# EasyEDA Pro project ProProject_keyboard_Tassel43_2024-03-30.epro, board Tassel43_Without_RGB_Right
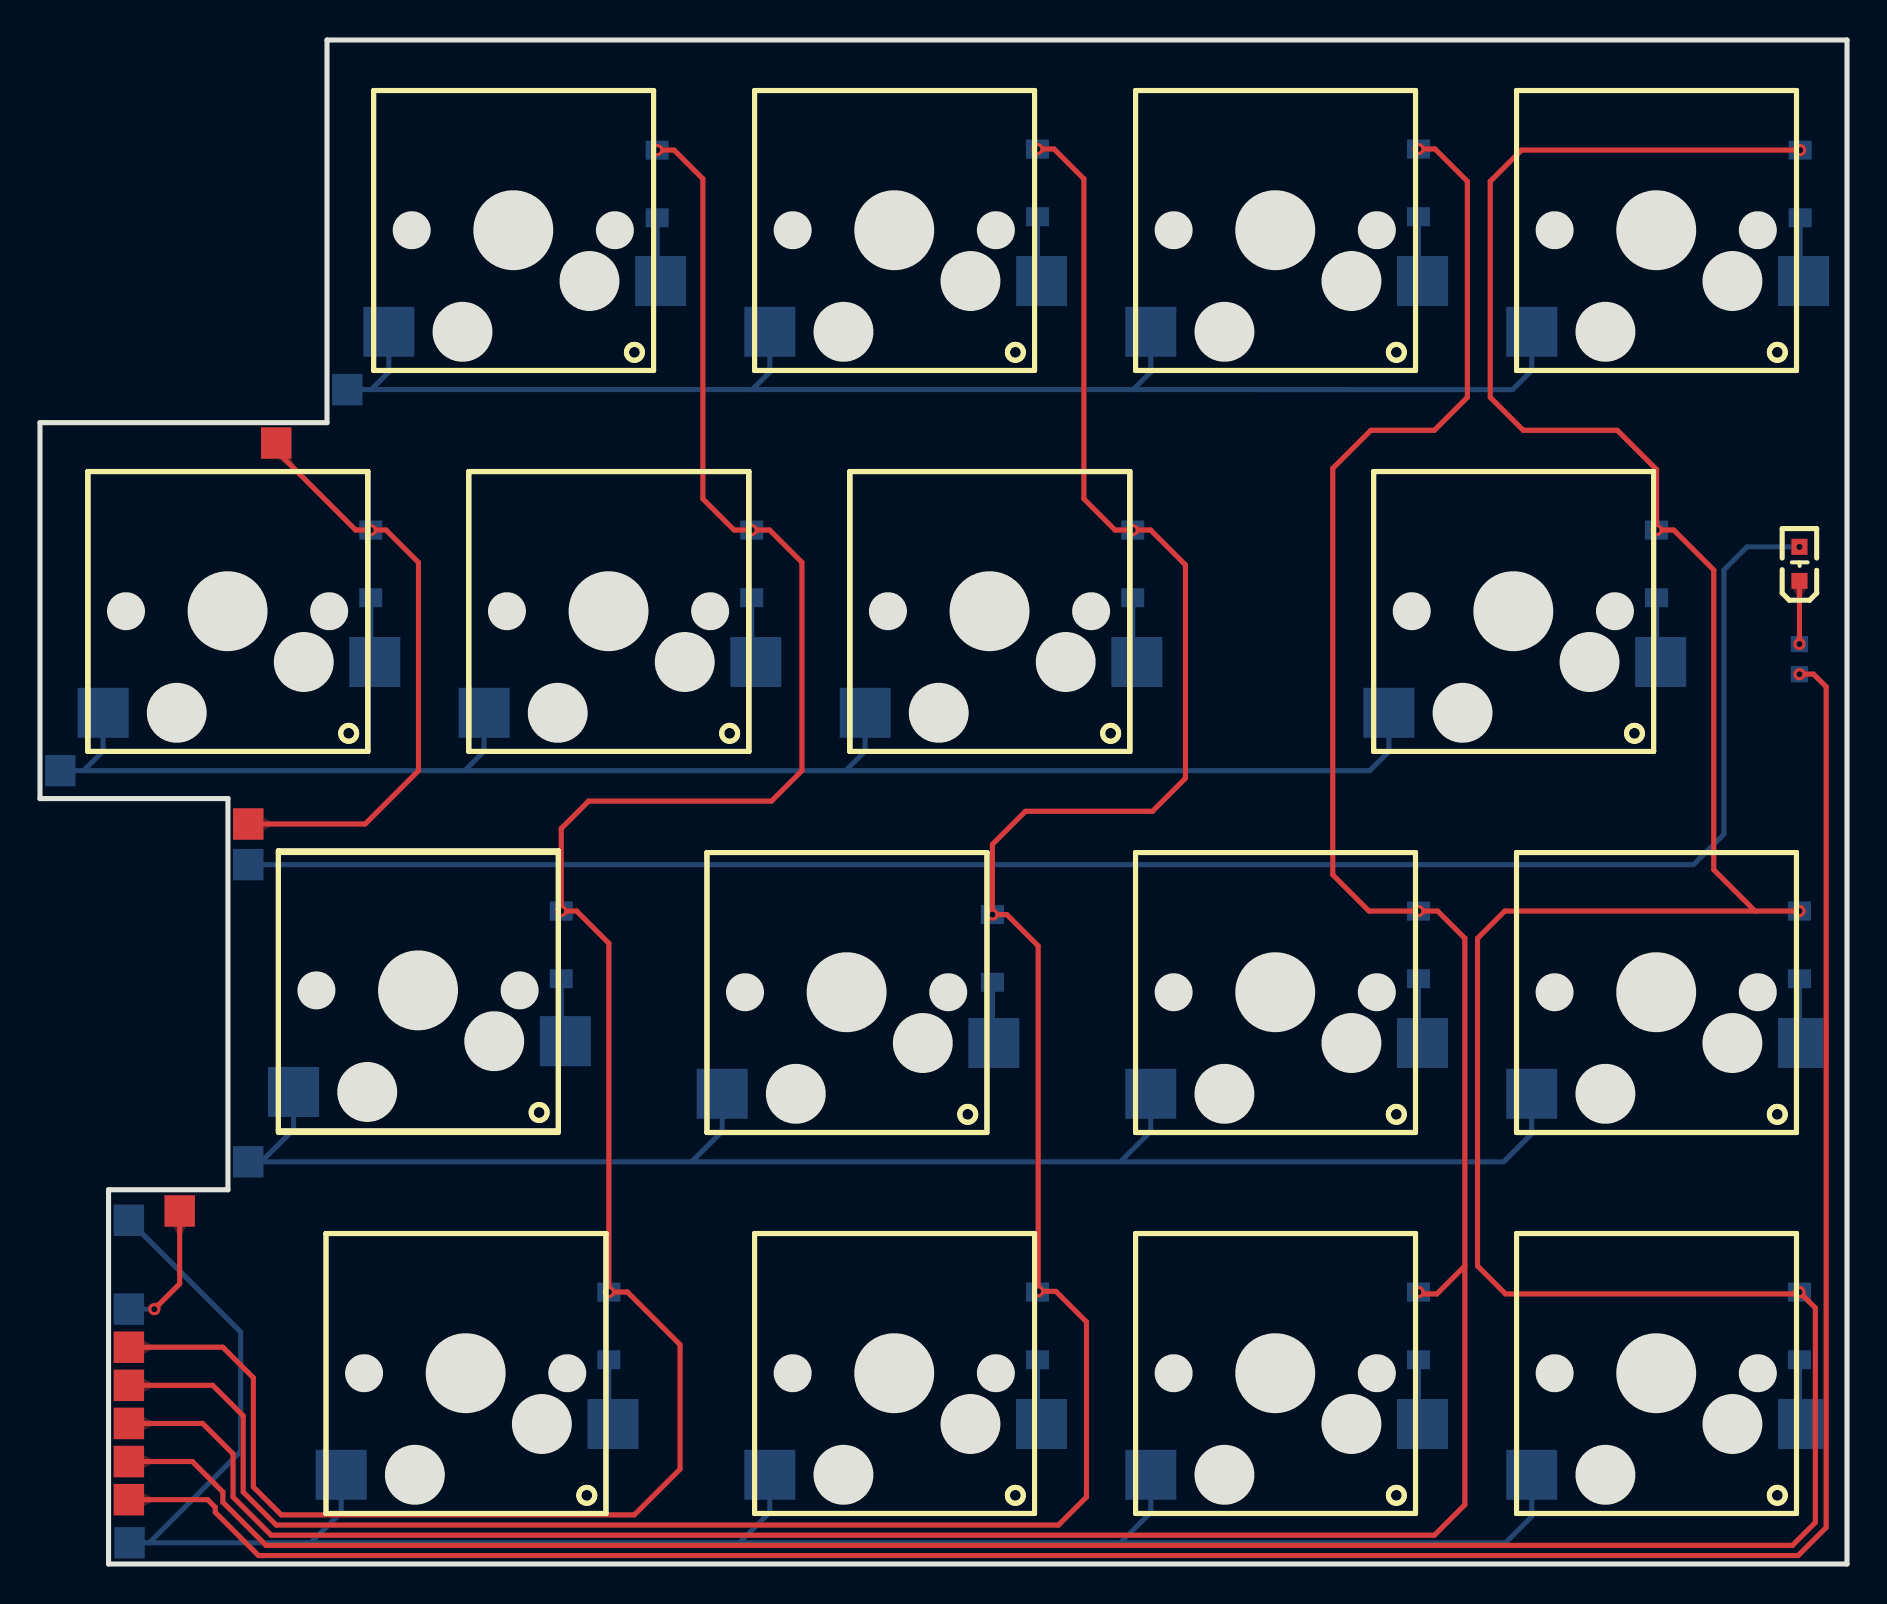
[diagram p7: board, top side]
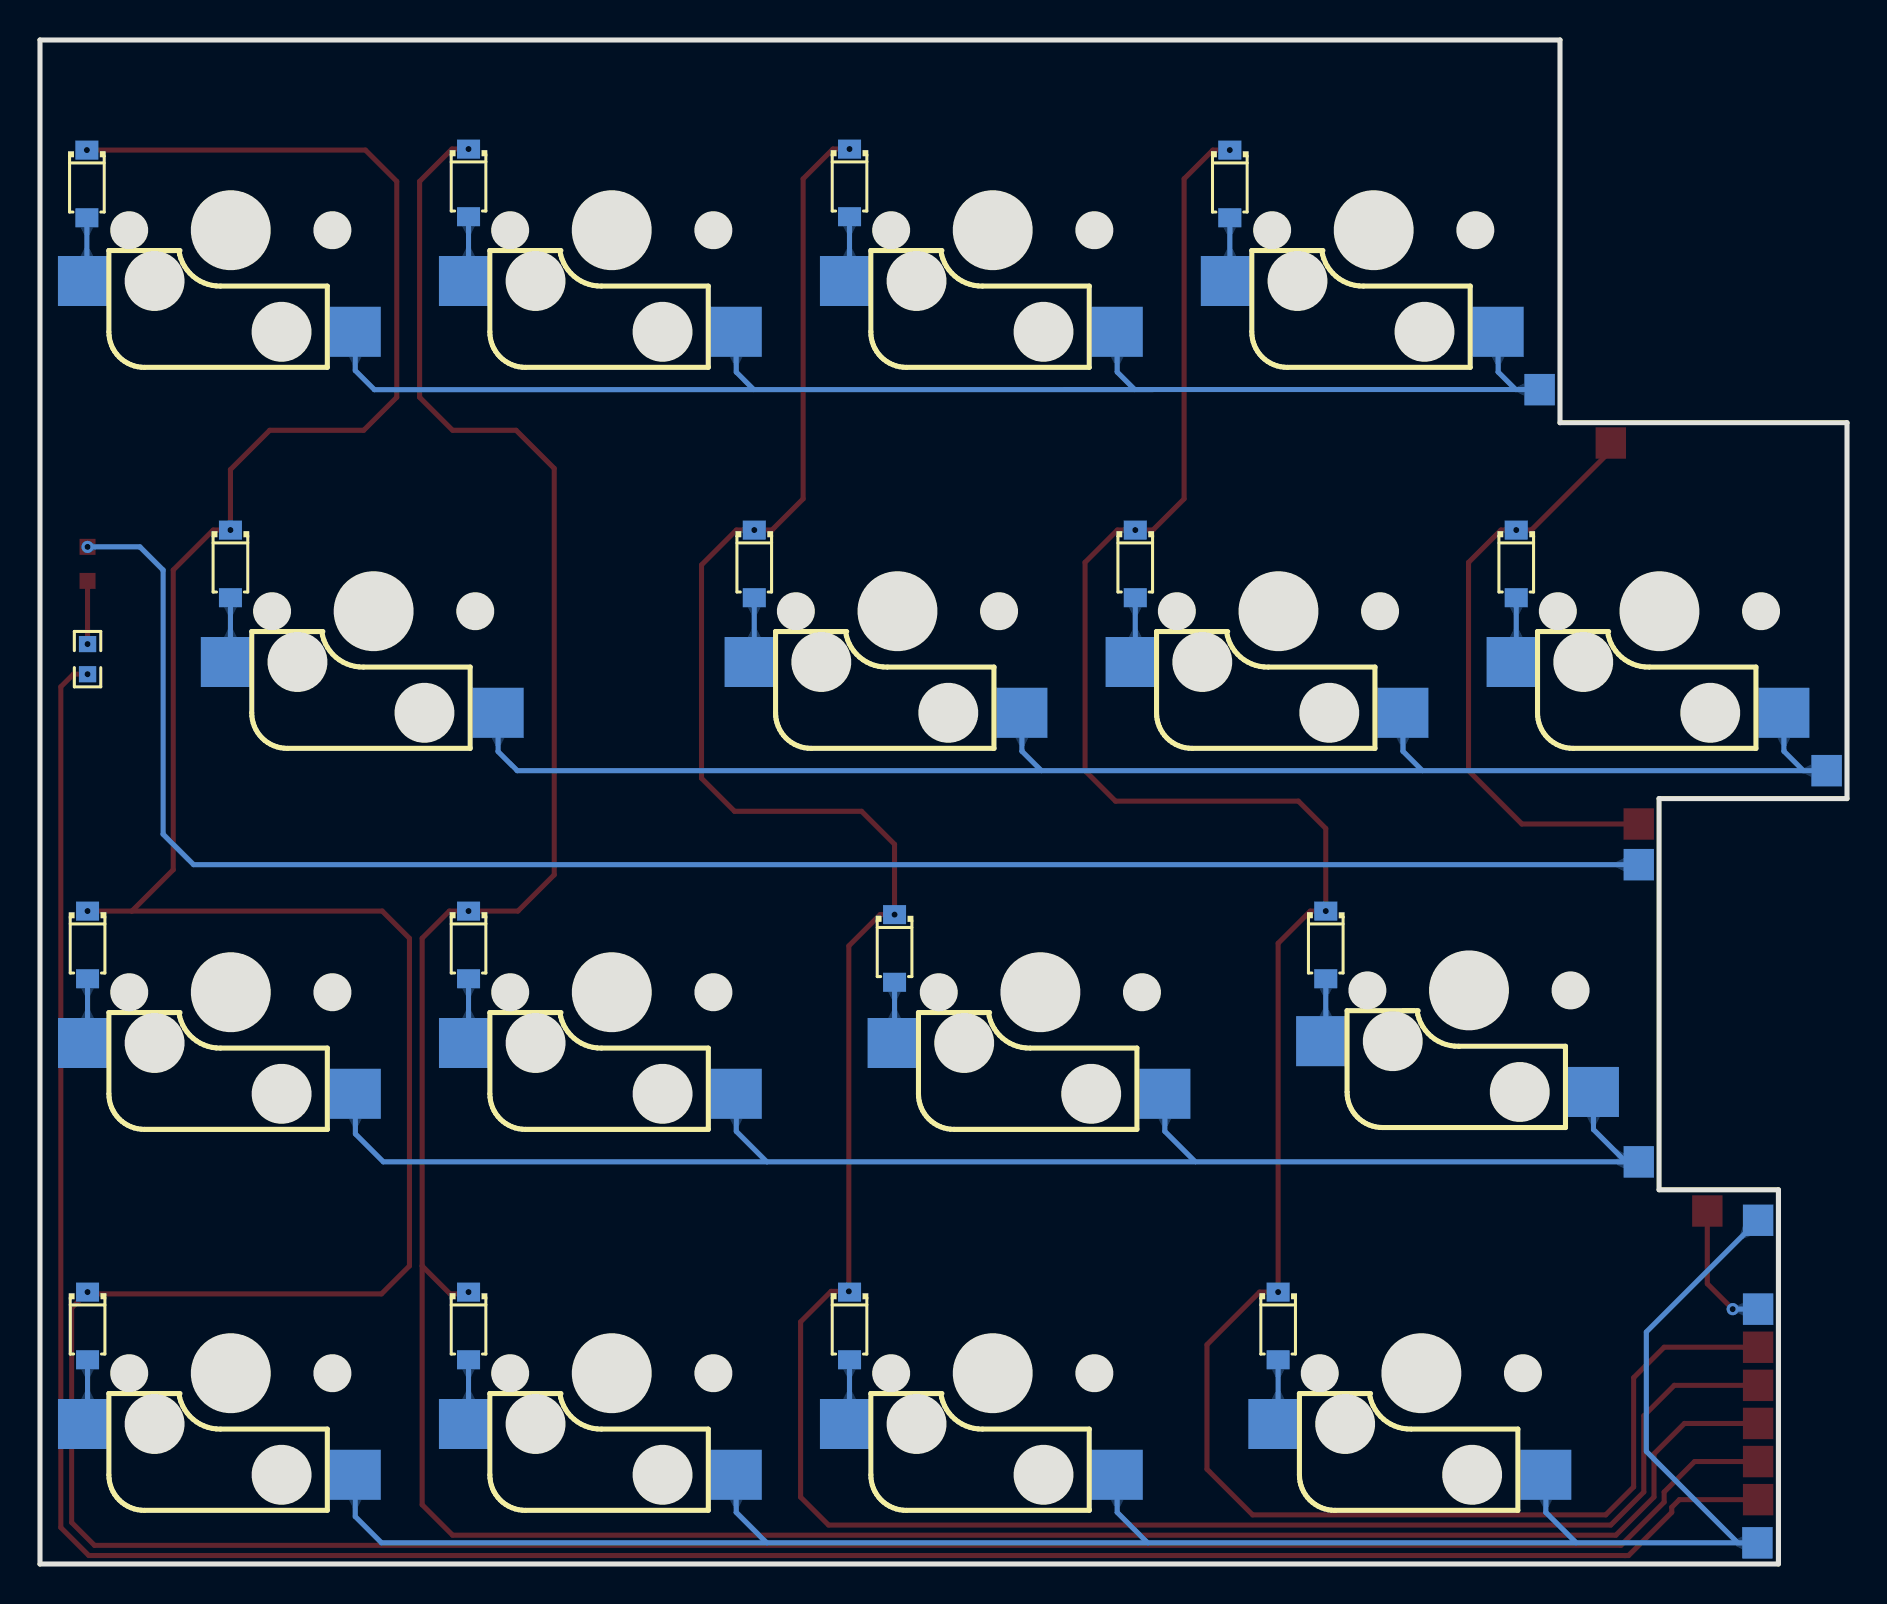
[diagram p8: board, bottom side, seen from below]

Outline 90.36 x 76.2 mm; copper layers: Top Layer, Bottom Layer. Coordinates in mm from the lower left corner of the outline.
Outline path: 0,57.07 0,38.27 9.4,38.27 9.4,18.71 3.43,18.71 3.43,0 90.36,0 90.36,76.2 14.35,76.2 14.35,57.07 0,57.07

## Placement (name value [footprint] x y rotation side)
BACKSPACE  -  [凯华热插拨]  80.82 66.69 0 top
D49  -  [SOD-123_L2.8-W1.8-LS3.7-RD]  28.44 11.9 270 bottom
D50  -  [SOD-123_L2.8-W1.8-LS3.7-RD]  49.88 11.9 270 bottom
D51  -  [SOD-123_L2.8-W1.8-LS3.7-RD]  68.93 11.9 270 bottom
D52  -  [SOD-123_L2.8-W1.8-LS3.7-RD]  87.98 11.9 270 bottom
D60  -  [SOD-123_L2.8-W1.8-LS3.7-RD]  26.06 30.96 270 bottom
D61  -  [SOD-123_L2.8-W1.8-LS3.7-RD]  47.62 30.78 270 bottom
D62  -  [SOD-123_L2.8-W1.8-LS3.7-RD]  68.93 30.96 270 bottom
D63  -  [SOD-123_L2.8-W1.8-LS3.7-RD]  87.98 30.96 270 bottom
D72  -  [SOD-123_L2.8-W1.8-LS3.7-RD]  16.54 50.01 270 bottom
D73  -  [SOD-123_L2.8-W1.8-LS3.7-RD]  35.59 50.01 270 bottom
D74  -  [SOD-123_L2.8-W1.8-LS3.7-RD]  54.64 50.01 270 bottom
D75  -  [SOD-123_L2.8-W1.8-LS3.7-RD]  80.83 50.01 270 bottom
D76  -  [SOD-123_L2.8-W1.8-LS3.7-RD]  88.01 69 270 bottom
D77  -  [SOD-123_L2.8-W1.8-LS3.7-RD]  68.93 69.06 270 bottom
D78  -  [SOD-123_L2.8-W1.8-LS3.7-RD]  49.88 69.06 270 bottom
D79  -  [SOD-123_L2.8-W1.8-LS3.7-RD]  30.86 69 270 bottom
DEL  -  [凯华热插拨]  80.81 28.59 0 top
ENTER  -  [凯华热插拨]  73.67 47.64 0 top
I  -  [凯华热插拨]  23.67 66.69 0 top
J  -  [凯华热插拨]  9.38 47.64 0 top
K  -  [凯华热插拨]  28.43 47.64 0 top
L  -  [凯华热插拨]  47.48 47.64 0 top
LED1  -  [LED0603-R-RD_RED]  87.98 50.01 90 top
LGUI2  -  [凯华热插拨]  21.28 9.54 0 top
LGUI3  -  [凯华热插拨]  42.72 9.54 0 top
LGUI4  -  [凯华热插拨]  61.77 9.54 0 top
LGUI5  -  [凯华热插拨]  80.82 9.54 0 top
M  -  [凯华热插拨]  18.9 28.68 0 top
NOREF  -  [Pad_e328]  10.41 34.97 0 top
NOREF#2  -  [Pad_e327]  10.41 20.11 0 top
NOREF#3  -  [Pad_e734]  4.44 10.84 0 top
NOREF#4  -  [Pad_e735]  4.44 8.93 0 top
NOREF#5  -  [Pad_e738]  4.44 3.22 0 top
NOREF#6  -  [Pad_e326]  4.44 17.19 0 top
NOREF#7  -  [Pad_e324]  4.44 12.74 0 top
NOREF#8  -  [Pad_e739]  6.98 17.65 0 top
NOREF#9  -  [Pad_e740]  10.41 37 0 top
NOREF#10  -  [Pad_e330]  15.37 58.72 0 top
NOREF#11  -  [Pad_e737]  4.44 5.12 0 top
NOREF#12  -  [Pad_e329]  1.02 39.67 0 top
NOREF#13  -  [Pad_e736]  4.44 7.03 0 top
NOREF#14  -  [Pad_e741]  11.81 56.05 0 top
NOREF#15  -  [Pad_e325]  4.48 1.06 0 top
O  -  [凯华热插拨]  42.72 66.69 0 top
P  -  [凯华热插拨]  61.77 66.69 0 top
R7  -  [R0603]  87.98 45.24 90 bottom
TO  -  [凯华热插拨]  40.33 28.59 0 top
UP  -  [凯华热插拨]  61.76 28.59 0 top

## Footprints (pads in the part's own frame, mm; a bottom-side part is the same pattern mirrored in y, then rotated)
LED0603-R-RD_RED
  rect 0.8x0.8 smd: 1(0.851,0) 2(-0.851,0)
Pad_e324
  rect 1.52x1.57 smd far side: 39(0,0)
Pad_e325
  rect 1.52x1.57 smd far side: 51(0,0)
Pad_e326
  rect 1.52x1.57 smd far side: 53(0,0)
Pad_e327
  rect 1.52x1.57 smd far side: 57(0,0)
Pad_e328
  rect 1.52x1.57 smd far side: 59(0,0)
Pad_e329
  rect 1.52x1.57 smd far side: 63(0,0)
Pad_e330
  rect 1.52x1.57 smd far side: 67(0,0)
Pad_e734
  rect 1.52x1.57 smd: 40(0,0)
Pad_e735
  rect 1.52x1.57 smd: 43(0,0)
Pad_e736
  rect 1.52x1.57 smd: 45(0,0)
Pad_e737
  rect 1.52x1.57 smd: 47(0,0)
Pad_e738
  rect 1.52x1.57 smd: 49(0,0)
Pad_e739
  rect 1.52x1.57 smd: 54(0,0)
Pad_e740
  rect 1.52x1.57 smd: 61(0,0)
Pad_e741
  rect 1.52x1.57 smd: 65(0,0)
R0603
  rect 0.806x0.864 smd: 1(-0.753,0) 2(0.753,0)
SOD-123_L2.8-W1.8-LS3.7-RD
  rect 0.95x1.15 smd: 1(-1.692,0) 2(1.692,0)
凯华热插拨
  rect 2.55x2.5 smd far side: K1(-6.223,-5.08) K2(7.366,-2.54)

## Nets
VCC: LED1.1 NOREF.59
CAPLED: NOREF#5.49 R7.1
CAPS1_4: D49.2 LGUI2.K2
COL7: D72.1 NOREF#7.39 NOREF#8.54 NOREF#9.61 NOREF#14.65
COL8: D49.1 D60.1 D73.1 D79.1 NOREF#3.40
COL9: D50.1 D61.1 D74.1 D78.1 NOREF#4.43
COL10: D51.1 D62.1 D77.1 NOREF#13.45
COL11: D52.1 D63.1 D75.1 D76.1 NOREF#11.47
D76_2: BACKSPACE.K2 D76.2
D77_2: D77.2 P.K2
D78_2: D78.2 O.K2
D79_2: D79.2 I.K2
DEL1_4: D63.2 DEL.K2
DOWN1_4: D51.2 LGUI4.K2
ENTER1_4: D75.2 ENTER.K2
J2_4: D72.2 J.K2
K1_4: D73.2 K.K2
L1_4: D74.2 L.K2
LEFT1_4: D50.2 LGUI3.K2
M1_4: D60.2 M.K2
R7_2: LED1.2 R7.2
RIGHT1_4: D52.2 LGUI5.K2
ROW0: BACKSPACE.K1 I.K1 NOREF#10.67 O.K1 P.K1
ROW1: ENTER.K1 J.K1 K.K1 L.K1 NOREF#12.63
ROW2: DEL.K1 M.K1 NOREF#2.57 TO.K1 UP.K1
ROW3: LGUI2.K1 LGUI3.K1 LGUI4.K1 LGUI5.K1 NOREF#6.53 NOREF#15.51
TO1_4: D61.2 TO.K2
UP1_4: D62.2 UP.K2

## Via types
v1: diameter 0.61, hole 0.305, Top Layer to Bottom Layer, 20 vias

## Routing (per net, layer and track width the routed paths; a pad name or vN(x,y) marks a point on that pad's centre or on a via; arc(x,y) is an arc through that point)
VCC: length 91.9
  Bottom Layer w0.254: v1(87.98,50.86) 85.36,50.86 84.2,49.7 84.2,36.49 82.68,34.97 10.42,34.97
CAPLED: length 130.5
  Top Layer w0.254: 11.18,0.42 10.92,0.42 8.76,2.58 8.76,2.84 8.38,3.22 NOREF#5.49 ; 11.05,0.42 87.91,0.42 89.31,1.82 89.31,43.86 88.68,44.49 87.98,44.49
  vias: v1(87.98,44.49)
CAPS1_4: length 3.3
  Bottom Layer w0.254: D49.2 28.45,7.21 LGUI2.K2
COL7: length 36.4
  Top Layer w0.254: NOREF#8.54 6.98,14.01 v1(5.72,12.74) ; 11.78,55.92 11.78,55.7 15.78,51.7 v1(16.54,51.7) 17.3,51.7 18.92,50.08 18.92,39.67 16.26,37 10.4,37
  Bottom Layer w0.254: v1(5.72,12.74) NOREF#7.39
COL8: length 119.5
  Top Layer w0.254: NOREF#3.40 9.14,10.84 10.67,9.31 10.67,3.85 12.06,2.46 29.72,2.46 32,4.74 32,10.97 29.37,13.6 28.45,13.6 28.45,31.03 26.83,32.65 26.06,32.65 26.06,36.77 27.43,38.14 36.58,38.14 38.1,39.67 38.1,50.08 36.48,51.7 34.7,51.7 33.15,53.26 33.15,69.26 31.71,70.7 v1(30.86,70.7)
  vias: v1(26.06,32.65) v1(28.44,13.6) v1(35.59,51.7)
COL9: length 136.2
  Top Layer w0.254: NOREF#4.43 8.64,8.93 10.16,7.41 10.16,3.6 11.81,1.95 50.93,1.95 52.32,3.34 52.32,12.11 50.8,13.63 v1(49.91,13.63) 49.91,30.9 48.35,32.47 v1(47.62,32.47) ; 49.88,70.75 50.71,70.75 52.2,69.26 52.2,53.26 53.75,51.7 55.53,51.7 57.28,49.95 57.28,39.29 55.63,37.64 49.28,37.64 47.62,35.98 47.62,32.47
  vias: v1(49.88,70.75) v1(54.64,51.7)
COL10: length 152.6
  Top Layer w0.254: 71.25,14.9 71.25,31.29 69.88,32.65 v1(68.93,32.65) ; 71.25,14.9 69.85,13.51 69.02,13.51 v1(68.93,13.6) ; 71.25,14.9 71.25,2.96 69.72,1.44 11.56,1.44 9.65,3.34 9.65,5.5 8.13,7.03 NOREF#13.45 ; 68.93,70.75 69.76,70.75 71.37,69.13 71.37,58.34 69.72,56.69 66.55,56.69 64.64,54.78 64.64,34.46 66.46,32.65 68.93,32.65
  vias: v1(68.93,70.75)
COL11: length 209.8
  Top Layer w0.254: 87.98,13.6 88.77,12.8 88.77,2.08 87.63,0.93 11.3,0.93 9.14,3.09 9.14,3.6 7.62,5.12 NOREF#11.47 ; 85.76,32.65 87.98,32.65 ; 85.76,32.65 83.69,34.71 83.69,49.7 81.69,51.7 v1(80.83,51.7) 80.83,54.72 78.87,56.69 74.17,56.69 72.52,58.34 72.52,69.13 74.08,70.7 v1(88.01,70.7) ; 85.76,32.65 73.24,32.65 71.88,31.29 71.88,14.9 73.28,13.51 87.89,13.51 v1(87.98,13.6)
  vias: v1(87.98,32.65)
D76_2: length 3.2
  Bottom Layer w0.254: D76.2 88.01,64.32 BACKSPACE.K2
D77_2: length 3.3
  Bottom Layer w0.254: 68.93,67.36 68.93,64.36 69.13,64.15
D78_2: length 3.3
  Bottom Layer w0.254: 49.88,67.36 49.88,64.36 50.08,64.15
D79_2: length 3.2
  Bottom Layer w0.254: D79.2 30.86,64.32 31.03,64.15
DEL1_4: length 3.3
  Bottom Layer w0.254: DEL.K2 87.98,26.25 87.98,29.26
DOWN1_4: length 3.3
  Bottom Layer w0.254: LGUI4.K2 68.93,7.2 D51.2
ENTER1_4: length 3.3
  Bottom Layer w0.254: 81.04,45.1 80.83,45.3 D75.2
J2_4: length 3.3
  Bottom Layer w0.254: D72.2 16.54,45.31 16.74,45.1
K1_4: length 3.3
  Bottom Layer w0.254: 35.59,48.31 35.59,45.31 35.79,45.1
L1_4: length 3.3
  Bottom Layer w0.254: 54.85,45.1 54.64,45.31 54.64,48.31
LEFT1_4: length 3.3
  Bottom Layer w0.254: 49.88,10.21 49.88,7.21 LGUI3.K2
M1_4: length 3.2
  Bottom Layer w0.254: M.K2 26.06,26.35 D60.2
R7_2: length 3.2
  Top Layer w0.254: 87.98,46 87.98,49.19
  vias: v1(87.98,46)
RIGHT1_4: length 3.3
  Bottom Layer w0.254: 87.98,10.21 87.98,7.2 LGUI5.K2
ROW0: length 71.3
  Bottom Layer w0.254: 54.66,58.72 55.54,59.6 P.K1 ; I.K1 17.44,59.6 16.56,58.72 ; 36.49,61.61 36.49,59.6 35.61,58.72 ; 15.37,58.72 73.63,58.72 74.59,59.67 74.59,61.61
ROW1: length 78.7
  Bottom Layer w0.254: 3.15,42.56 3.15,40.64 2.18,39.67 ; ENTER.K1 67.45,40.62 66.49,39.67 1,39.67 ; K.K1 22.2,40.64 21.23,39.67 ; 41.26,42.56 41.26,40.64 40.28,39.67
ROW2: length 78.9
  Bottom Layer w0.254: 55.54,23.51 55.54,21.63 54.02,20.11 ; 11.15,20.2 12.68,21.72 12.68,23.6 ; 10.37,20.11 73.19,20.11 74.58,21.51 DEL.K1 ; 32.59,20.11 34.11,21.63 34.11,23.51
ROW3: length 105.2
  Bottom Layer w0.254: 34.97,1.06 36.49,2.58 36.49,4.46 ; 15.06,4.46 15.06,2.58 13.54,1.06 ; 54.02,1.06 55.54,2.58 LGUI4.K1 ; NOREF#6.53 10.03,11.6 10.03,5.63 5.46,1.06 ; NOREF#15.51 73.28,1.06 74.59,2.37 74.59,4.46
TO1_4: length 3.1
  Bottom Layer w0.254: TO.K2 47.62,26.12 47.62,29.09
UP1_4: length 3.3
  Bottom Layer w0.254: D62.2 68.93,26.25 UP.K2

## Copper pours and planes (outline as drawn; the poured copper is in the pictures)
GND on Top Layer: -1.4,78.28 92.46,78.28 92.58,78.4 92.58,-2.88 -1.4,-2.88
GND on Bottom Layer: -1.4,78.28 92.46,78.28 92.58,78.4 92.58,-2.88 -1.4,-2.88

Small or netless copper shapes (teardrops, artwork), in the pictures only: 38 on Top Layer, 58 on Bottom Layer
